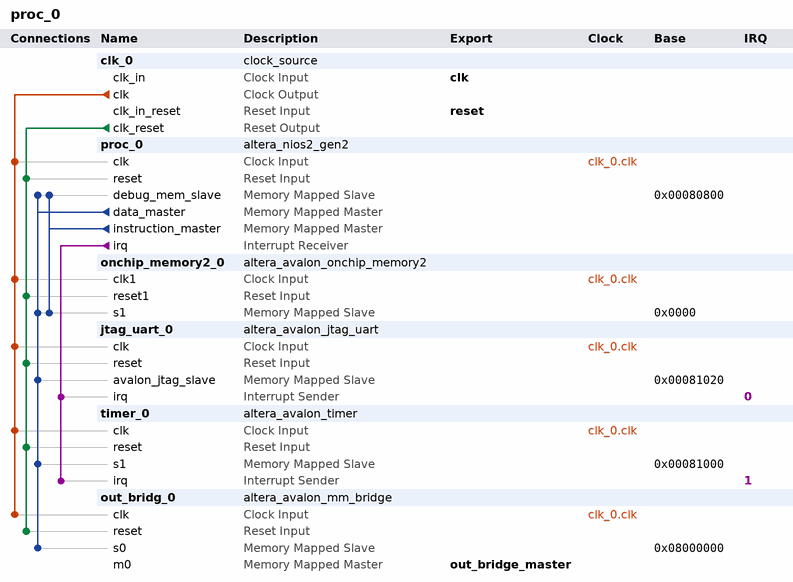
[diagram p0: system contents]
# Platform Designer (Qsys) system proc_0, Cyclone V 5CSEMA5F31C6
# Parameters at their usual value, and those the tool derives, are not listed.
package require -exact qsys 16.1
create_system proc_0
set_project_property DEVICE_FAMILY {Cyclone V}
set_project_property DEVICE 5CSEMA5F31C6

add_instance clk_0 clock_source 16.1
set_instance_parameter_value clk_0 clockFrequency 143000000

add_instance proc_0 altera_nios2_gen2 16.1
set_instance_parameter_value proc_0 dcache_size 2048
set_instance_parameter_value proc_0 exceptionSlave onchip_memory2_0.s1
set_instance_parameter_value proc_0 icache_size 4096
set_instance_parameter_value proc_0 impl Fast
set_instance_parameter_value proc_0 resetSlave onchip_memory2_0.s1

add_instance onchip_memory2_0 altera_avalon_onchip_memory2 16.1
set_instance_parameter_value onchip_memory2_0 dataWidth 32
set_instance_parameter_value onchip_memory2_0 dualPort false
set_instance_parameter_value onchip_memory2_0 initMemContent true
set_instance_parameter_value onchip_memory2_0 initializationFileName onchip_mem.hex
set_instance_parameter_value onchip_memory2_0 memorySize 300000

add_instance jtag_uart_0 altera_avalon_jtag_uart 16.1
set_instance_parameter_value jtag_uart_0 simInteractiveOptions NO_INTERACTIVE_WINDOWS

add_instance timer_0 altera_avalon_timer 16.1
set_instance_parameter_value timer_0 fixedPeriod true
set_instance_parameter_value timer_0 period 1
set_instance_parameter_value timer_0 periodUnits MSEC

add_instance out_bridg_0 altera_avalon_mm_bridge 16.1
set_instance_parameter_value out_bridg_0 ADDRESS_UNITS SYMBOLS
set_instance_parameter_value out_bridg_0 ADDRESS_WIDTH 10
set_instance_parameter_value out_bridg_0 DATA_WIDTH 32
set_instance_parameter_value out_bridg_0 MAX_PENDING_RESPONSES 4
set_instance_parameter_value out_bridg_0 USE_AUTO_ADDRESS_WIDTH 1

# connections
add_connection clk_0.clk jtag_uart_0.clk clock
add_connection clk_0.clk onchip_memory2_0.clk1 clock
add_connection clk_0.clk out_bridg_0.clk clock
add_connection clk_0.clk proc_0.clk clock
add_connection clk_0.clk timer_0.clk clock
add_connection clk_0.clk_reset jtag_uart_0.reset reset
add_connection clk_0.clk_reset onchip_memory2_0.reset1 reset
add_connection clk_0.clk_reset out_bridg_0.reset reset
add_connection clk_0.clk_reset proc_0.reset reset
add_connection clk_0.clk_reset timer_0.reset reset
add_connection proc_0.data_master jtag_uart_0.avalon_jtag_slave avalon
set_connection_parameter_value proc_0.data_master/jtag_uart_0.avalon_jtag_slave baseAddress 0x00081020
add_connection proc_0.data_master onchip_memory2_0.s1 avalon
set_connection_parameter_value proc_0.data_master/onchip_memory2_0.s1 baseAddress 0x0000
add_connection proc_0.data_master out_bridg_0.s0 avalon
set_connection_parameter_value proc_0.data_master/out_bridg_0.s0 baseAddress 0x08000000
add_connection proc_0.data_master proc_0.debug_mem_slave avalon
set_connection_parameter_value proc_0.data_master/proc_0.debug_mem_slave baseAddress 0x00080800
add_connection proc_0.data_master timer_0.s1 avalon
set_connection_parameter_value proc_0.data_master/timer_0.s1 baseAddress 0x00081000
add_connection proc_0.instruction_master onchip_memory2_0.s1 avalon
set_connection_parameter_value proc_0.instruction_master/onchip_memory2_0.s1 baseAddress 0x0000
add_connection proc_0.instruction_master proc_0.debug_mem_slave avalon
set_connection_parameter_value proc_0.instruction_master/proc_0.debug_mem_slave baseAddress 0x00080800
add_connection proc_0.irq jtag_uart_0.irq interrupt
set_connection_parameter_value proc_0.irq/jtag_uart_0.irq irqNumber 0
add_connection proc_0.irq timer_0.irq interrupt
set_connection_parameter_value proc_0.irq/timer_0.irq irqNumber 1

# exported interfaces
add_interface clk clock sink
set_interface_property clk EXPORT_OF clk_0.clk_in
add_interface out_bridge_master avalon master
set_interface_property out_bridge_master EXPORT_OF out_bridg_0.m0
add_interface reset reset sink
set_interface_property reset EXPORT_OF clk_0.clk_in_reset

set_interconnect_requirement {$system} qsys_mm.clockCrossingAdapter HANDSHAKE
set_interconnect_requirement {$system} qsys_mm.enableEccProtection FALSE
set_interconnect_requirement {$system} qsys_mm.insertDefaultSlave FALSE
set_interconnect_requirement {$system} qsys_mm.maxAdditionalLatency 1

save_system proc_0.qsys
